# EAGLE design FDL-2 DCP (EAGLE 8.3.2)
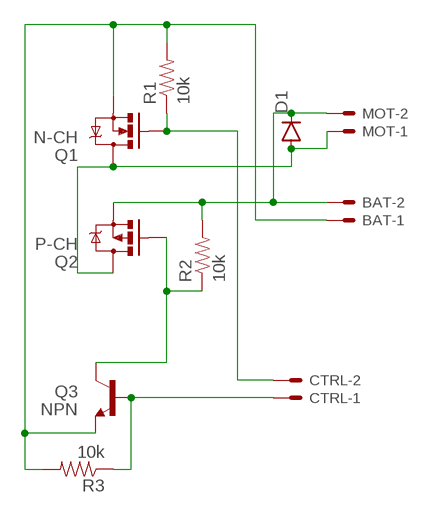
[diagram p0: schematic, sheet 1]

## Parts
BAT  JST-XH-02-PIN-LONG-PAD  [JST-XH-02-PACKAGE-LONG-PAD]
CTRL  JST-XH-02-PIN-LONG-PAD  [JST-XH-02-PACKAGE-LONG-PAD]
D1  DIODEPTH  [DIODE-1N4001]
MOT  JST-XH-02-PIN-LONG-PAD  [JST-XH-02-PACKAGE-LONG-PAD]
Q1  N-CH  MOSFET-NCHANNELFQP30N06L  [TO220V]
Q2  P-CH  MOSFET-PCHANNELNDP6020P_20V_24A_LOW_VGS_TH  [TO220V]
Q3  NPN  TRANSISTOR_NPN2N3904  [TO-92]
R1  10k  10KOHM-1/4W-1%(PTH)HORIZ-KIT  [AXIAL-0.3EZ]
R2  10k  10KOHM-1/4W-1%(PTH)HORIZ-KIT  [AXIAL-0.3EZ]
R3  10k  10KOHM-1/4W-1%(PTH)HORIZ-KIT  [AXIAL-0.3EZ]

## Nets
N$1: CTRL.1 Q3.2(B) R3.P$1
N$2: Q2.1(G) Q3.3(C) R2.P$1
N$3: BAT.1 Q1.3(S) Q3.1(E) R1.P$2 R3.P$2
N$4: CTRL.2 Q1.1(G) R1.P$1
N$5: BAT.2 D1.C MOT.2 Q2.3(S) R2.P$2
N$8: D1.A MOT.1 Q1.2(D) Q2.2(D)

## Library data of the parts
BAT CTRL MOT = Rembrandt Electronics - JST XH Connectors v1-0:JST-XH-02-PIN: JST XH Connector 2 Pin Wire to board connector. Pitch: 2,54 mm, (0.100") Number of pins: 2 Created by Rembrandt Electronics www.rembrandtelectronics.com
D1 = SparkFun-DiscreteSemi:DIODE: Diode These are standard reverse protection diodes and small signal diodes. SMA package can handle up to about 1A. SOD-323 can handle about 200mA. What the SOD-323 package when ordering, there are some mfgs out there that are 5-pin packages.
Q1 = SparkFun-DiscreteSemi:MOSFET-NCHANNEL: Common NMOSFET Parts MFG P/N Store ID Prod ID FDD8780 TRANS-09984 SI7820DN TRANS-11055 FDS6630A IC-08089 2N7002PW TRANS-11151 FQP30N06L COM-10213 TRANS-10060 BSS123LT1G TRANS-08345 BSS138 TRANS-00830 BS170 2N7000; PROD_ID: TRANS-10060
Q2 = SparkFun-DiscreteSemi:MOSFET-PCHANNEL: Generic PMOSFET IRLML2244 - TRANS-11153 (SOT-23 -20V -4.3A) (1.Gate 2.Source 3.Drain) FQP27P06 - COM-10349 <http://www.sparkfun.com/products/10349> (TO-220 -60V -27A) (1.Gate 2.Source 3.Drain); PROD_ID: TRANS-13060
Q3 = SparkFun-DiscreteSemi:TRANSISTOR_NPN: Generic NPN BJT MMBT2222A - TRANS-08049 (SOT-23, 1A 40V) MPSA42 - TRANS-09116 (SOT-23, 500mA 300V) MMBT5088LT1G - TRANS-11160 (SOT-23, 50 mA 30V) BC547 - COM-08928 <http://www.sparkfun.com/products/8928> (TO-92 45V 100mA) (1.Collector 2.Base 3.Emitter) 2N3904 - COM-00521 <http://www.sparkfun.com/products/521> (TO-92 40V 200mA) (1.Emitter 2.Base 3.Collector) P2N2222A - COM-12852 <http://www.sparkfun.com/products/12852> (TO-92 40V 600mA) (1.Collector 2.Base 3.Emitter); PROD_ID: TRANS-08447
R1-R3 = SparkFun-Resistors:10KOHM-1/4W-1%(PTH): RES-12183; PROD_ID: RES-12183

## Board
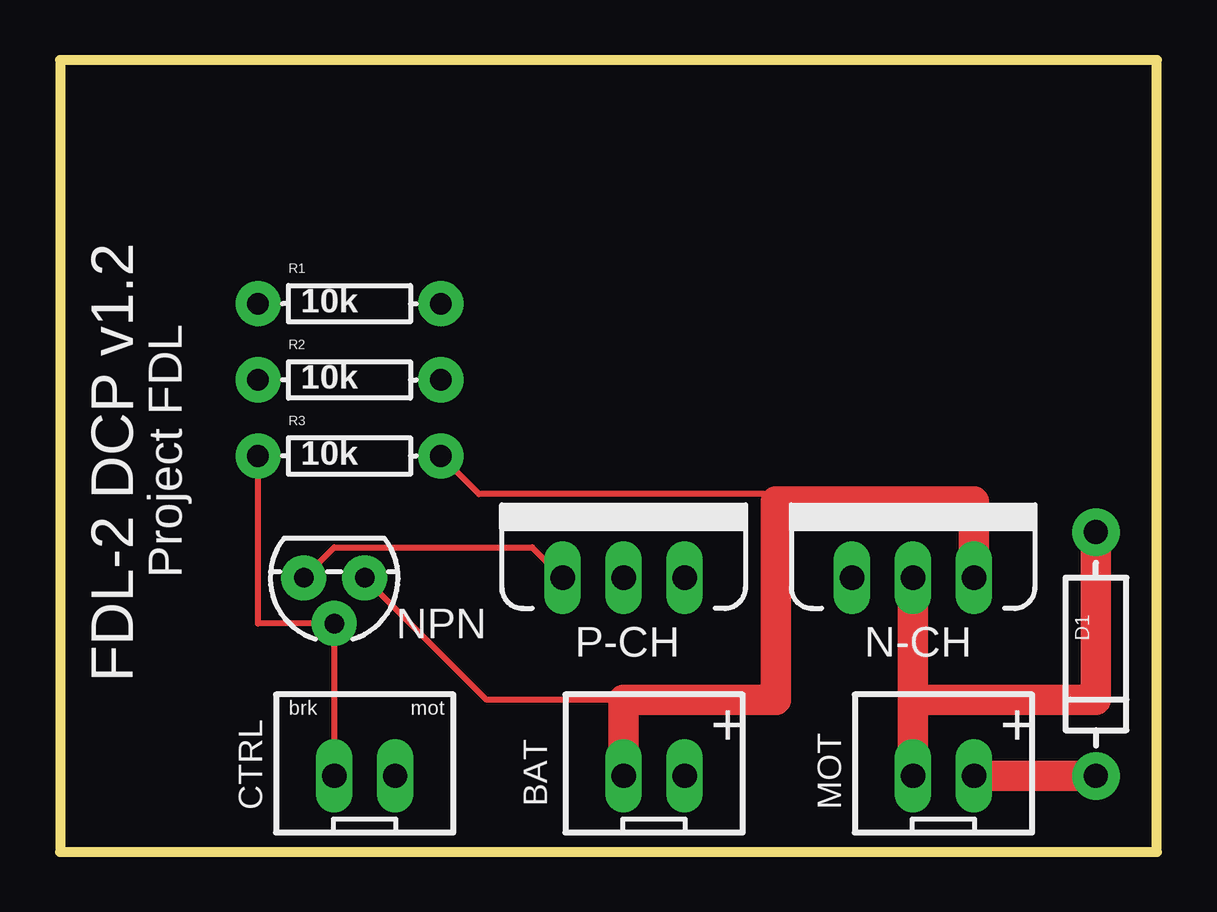
[diagram p1: board, top side]
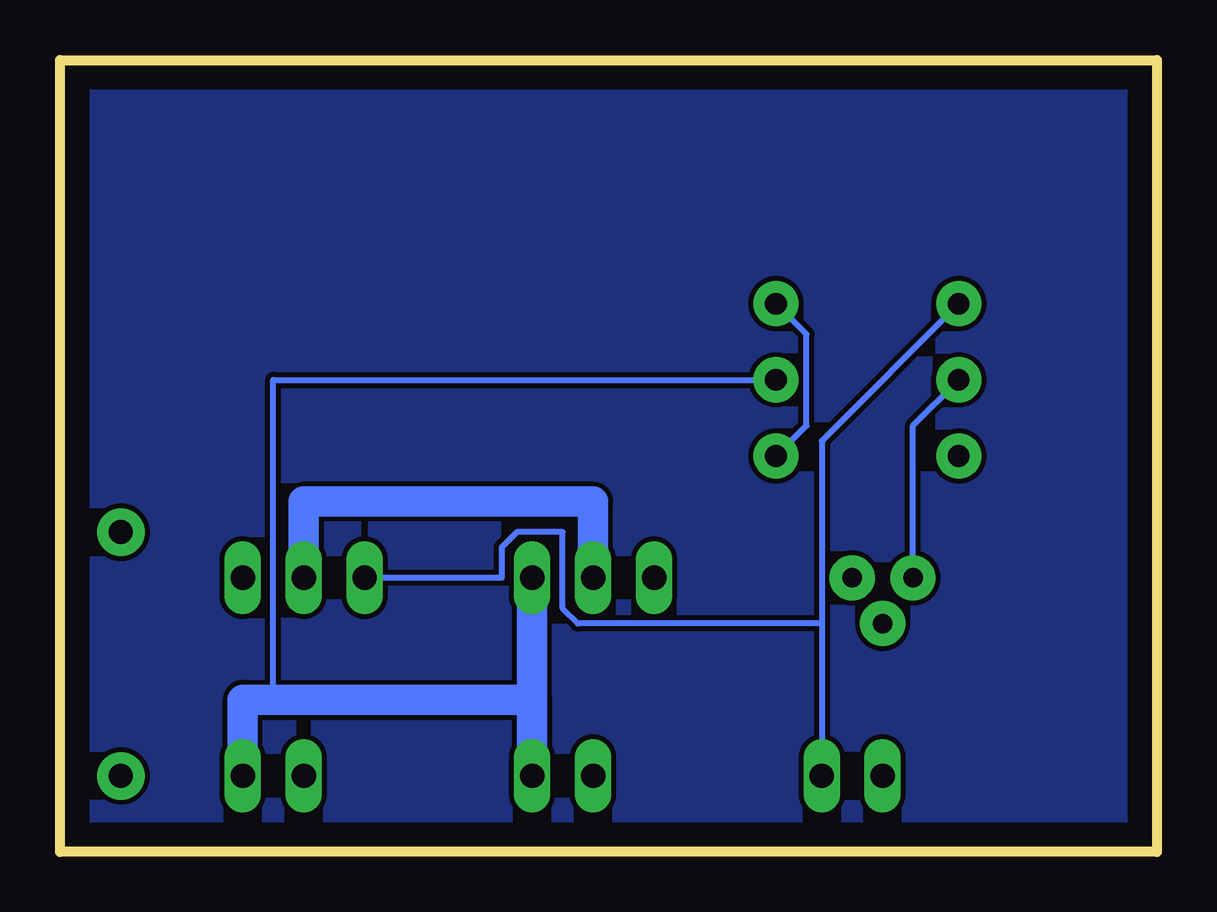
[diagram p2: board, bottom side, seen from below]

Size 45.72 x 33.02 mm. Coordinates in mm from the lower left corner, seen from the top.
Outline: 0,0 45.72,0 45.72,33.02 0,33.02 0,0
Copper layers (1*16): Top 0.035mm / dielectric 1.5mm / Bottom 0.035mm
Design rules "default": minimum track width 10mil, minimum drill 24mil, track to track 8mil, track to pad 8mil, pad to pad 8mil, via to via 8mil, smd to smd 8mil, copper to edge 40mil, drill to drill 8mil, minimum pad ring 10mil, minimum via ring 8mil, stop-mask expansion 4mil, vias tented up to drill 0mil, thermal gap 10mil

### Footprints (pad centres in the part's own frame; a part is rotated, then mirrored left to right if it is on the bottom)
JST-XH-02-PACKAGE-LONG-PAD = drill 1.016 long: 1 -1.27,0; 2 1.27,0
DIODE-1N4001 = drill 1 pad 1.981: A -5.08,0; C 5.08,0
TO220V = drill 1.016 long: 1 -2.54,0; 2 0,0; 3 2.54,0
TO-92 = drill 0.813 pad 1.88: 1 -1.27,0; 2 0,1.905; 3 1.27,0
AXIAL-0.3EZ = drill 0.9 pad 1.88: P$1 -3.81,0; P$2 3.81,0

### Placement (x,y rotation side)
BAT  24.77,3.17 0 top
CTRL  12.7,3.17 0 top
D1  43.18,8.26 270 top
MOT  36.83,3.17 0 top
Q1  35.56,11.43 0 top
Q2  23.5,11.43 0 top
Q3  11.43,11.43 180 top
R1  12.06,22.86 0 top
R2  12.06,19.68 0 top
R3  12.06,16.51 0 top

### Tracks (layer width: path | path; a pad name or v marks a point on that pad's centre or on a via)
N$1
  Top 0.254: CTRL.1 Q3.2 8.26,9.53 R3.P$1
N$2
  Top 0.254: Q2.1 19.68,12.7 11.43,12.7 Q3.3
  Bottom 0.254: R2.P$1 10.16,17.78 Q3.3
N$3
  Top 0.254: 15.24,16.51 R3.P$2 17.46,14.92 29.53,14.92 29.84,14.61 | Q3.1 17.78,6.35 23.5,6.35
  Top 1.27: Q1.3 38.1,14.61 29.84,14.61 29.84,6.35 23.5,6.35 BAT.1
  Bottom 0.254: R1.P$2 14.61,21.59 14.61,17.78 R3.P$2
N$4
  Bottom 0.254: 13.97,9.53 13.97,17.14 R1.P$1 | 13.97,9.53 CTRL.2 | Q1.1 27.3,11.43 27.3,12.7 26.67,13.34 24.77,13.34 24.77,10.16 24.13,9.53 13.97,9.53
N$5
  Top 1.27: MOT.2 D1.C
  Bottom 0.254: R2.P$2 36.83,19.68 36.83,6.35
  Bottom 1.27: MOT.2 38.1,6.35 36.83,6.35 26.04,6.35 BAT.2 Q2.3
N$8
  Top 1.27: MOT.1 35.56,6.35 | 35.56,6.35 43.18,6.35 D1.A | 35.56,6.35 Q1.2
  Bottom 1.27: Q2.2 23.5,14.61 35.56,14.61 Q1.2
N$9
  pour Bottom: 0,0 45.72,0 45.72,33.02 0,33.02

### Text on the board
tNames: FDL-2 DCP v1.2 | Project FDL | brk | mot | + | +